# Altium project 8x8_Crosspoint_Switch.PrjPcb (part 1 of 4)
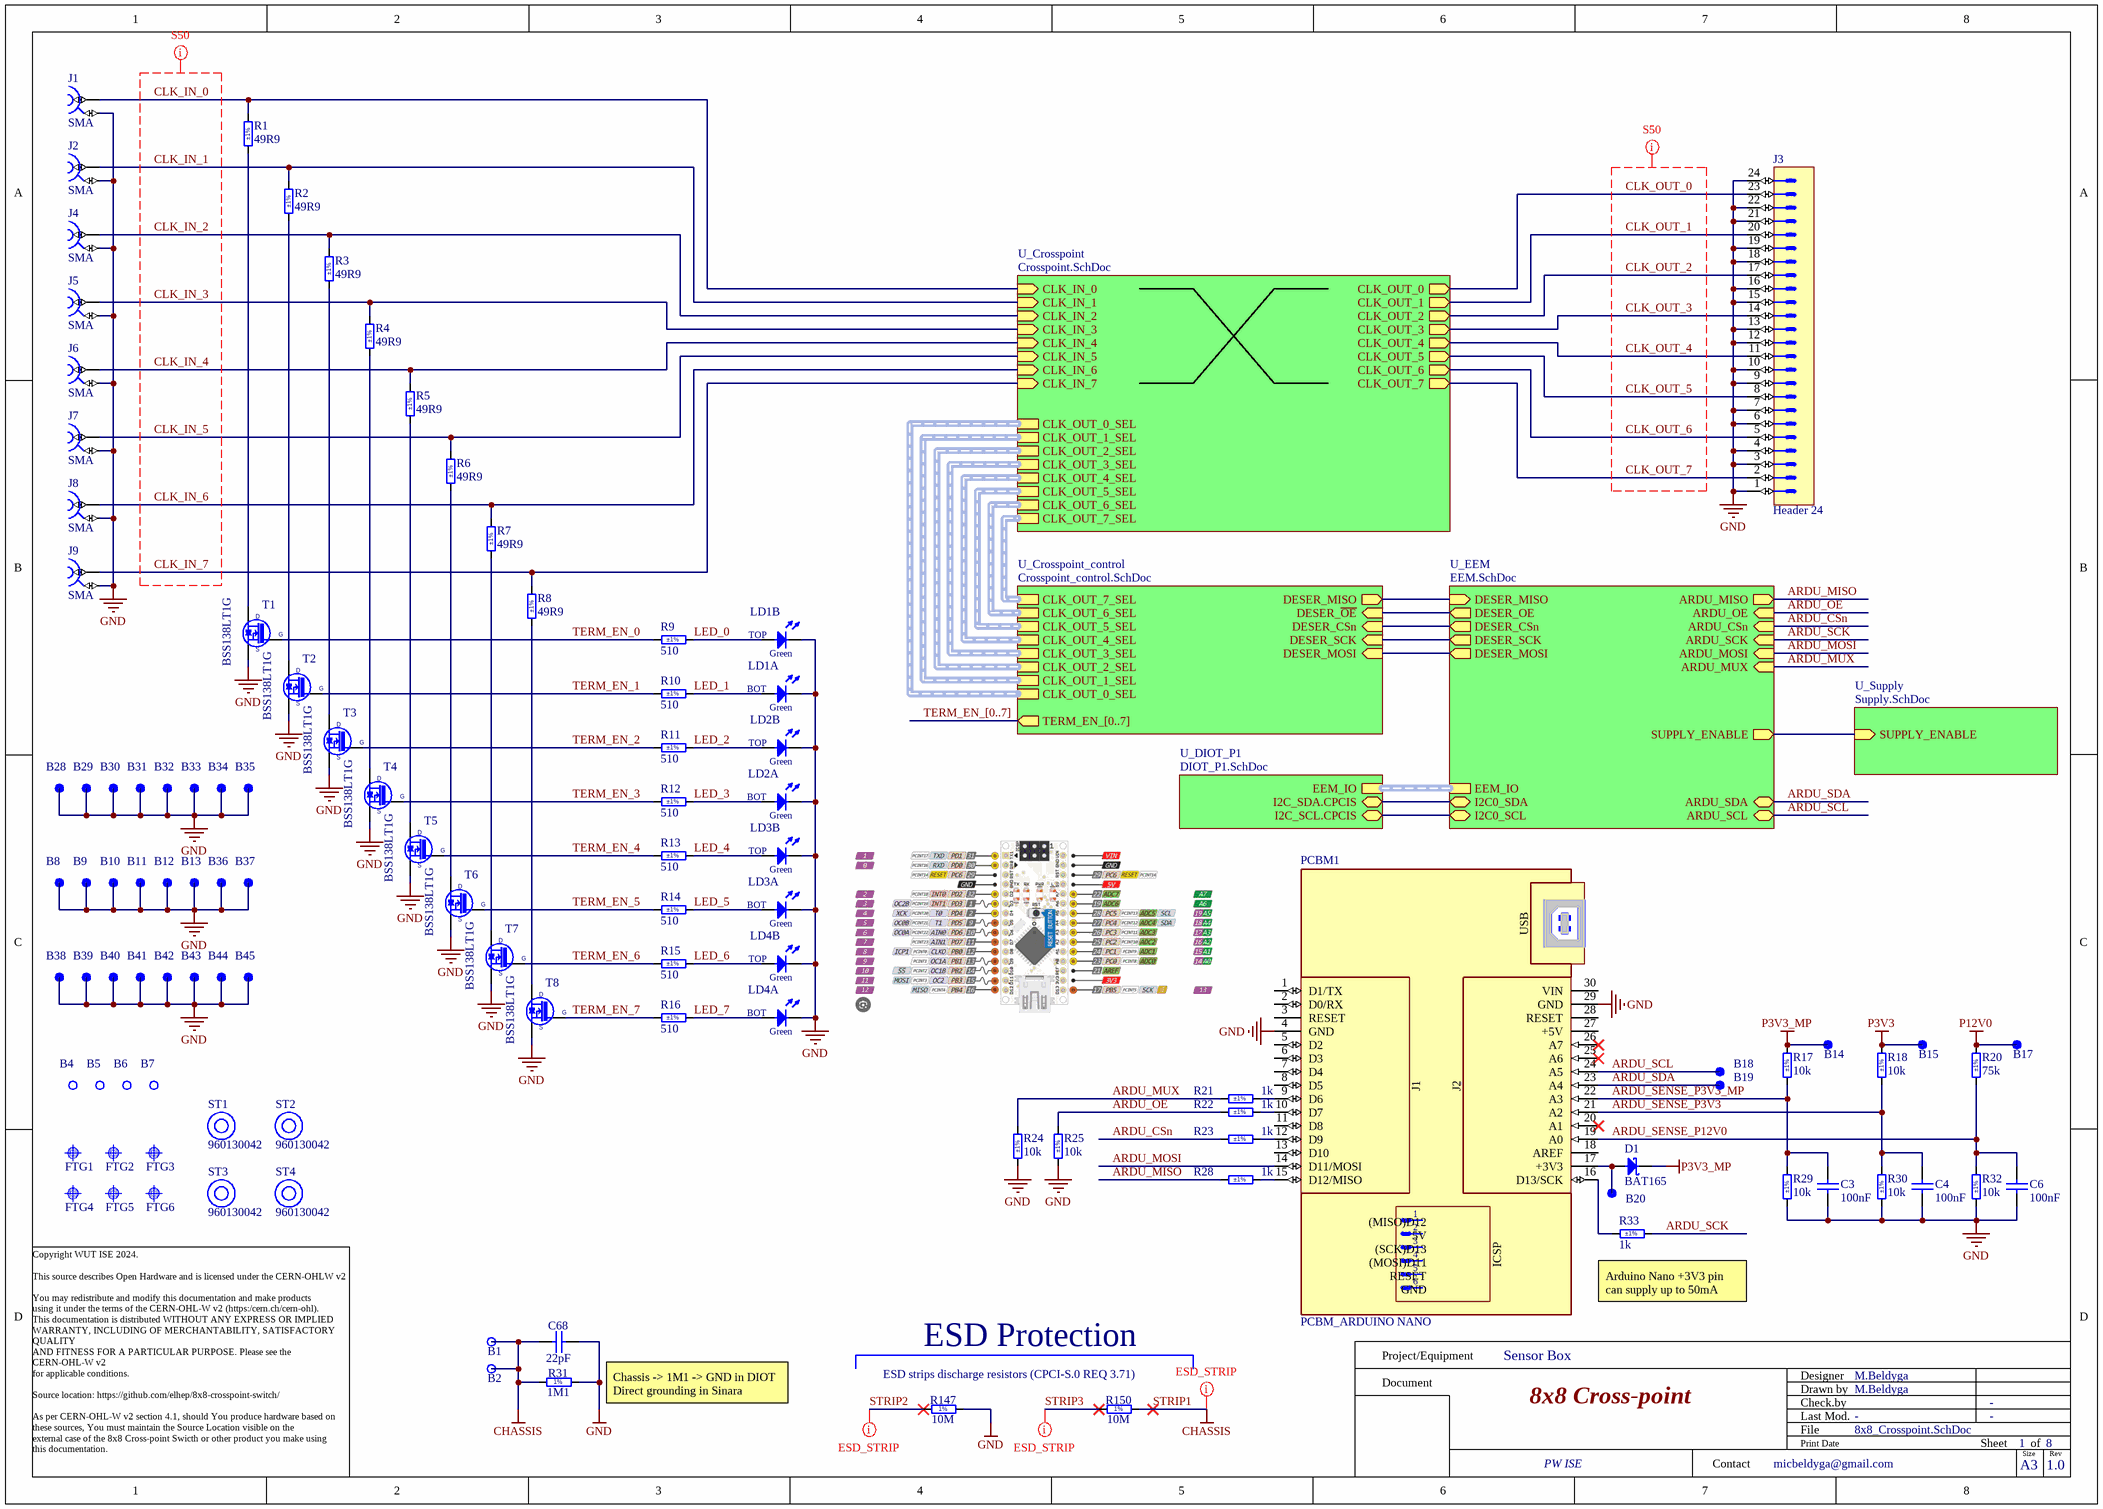
[diagram p0: 8x8_Crosspoint.SchDoc]
Revision: 1.0
8 sheets, 745 parts. Net scope: hierarchical (ports join the sheet entries above them; power ports are global).
Board file: 8x8_Crosspoint_Switch.PcbDoc
Sheets:
  8x8_Crosspoint.SchDoc
    U_Crosspoint = Crosspoint.SchDoc
      U_1-to-8_Fanout = 1-to-8_Fanout.SchDoc
      U_1-to-8_Fanout = 1-to-8_Fanout.SchDoc
      U_1-to-8_Fanout = 1-to-8_Fanout.SchDoc
      U_1-to-8_Fanout = 1-to-8_Fanout.SchDoc
      U_1-to-8_Fanout = 1-to-8_Fanout.SchDoc
      U_1-to-8_Fanout = 1-to-8_Fanout.SchDoc
      U_1-to-8_Fanout = 1-to-8_Fanout.SchDoc
      U_1-to-8_Fanout = 1-to-8_Fanout.SchDoc
      U_8-to-1_MUX = 8-to-1_MUX.SchDoc
      U_8-to-1_MUX = 8-to-1_MUX.SchDoc
      U_8-to-1_MUX = 8-to-1_MUX.SchDoc
      U_8-to-1_MUX = 8-to-1_MUX.SchDoc
      U_8-to-1_MUX = 8-to-1_MUX.SchDoc
      U_8-to-1_MUX = 8-to-1_MUX.SchDoc
      U_8-to-1_MUX = 8-to-1_MUX.SchDoc
      U_8-to-1_MUX = 8-to-1_MUX.SchDoc
    U_Crosspoint_control = Crosspoint_control.SchDoc
    U_DIOT_P1 = DIOT_P1.SchDoc
    U_EEM = EEM.SchDoc
    U_Supply = Supply.SchDoc

## Sheet 8x8_Crosspoint.SchDoc: 8x8 Cross-point
size A3; Author: M.Beldyga; CompanyName: WUT ISE; DrawnBy: M.Beldyga; Organization: WUT ISE; Address1: PW ISE; Address2: Nowowiejska 15/19 00-665 Warsaw; Address3: micbeldyga@gmail.com; SheetNumber: 1; SheetTotal: 8; ModifiedBy: -; CheckedDate: -; DivGrp: WUT ISE; Designer: M.Beldyga; ModifiedDate: -; ProjectName: Sensor Box

### Parts
B1  Plated Hole  [MTG270_500]  (value not drawn)  (no BOM)
B2  Plated Hole  [MTG270_500]  (value not drawn)  (no BOM)
B4  Plated Hole  [MTG320_550]  (value not drawn)  (no BOM)
B5  Plated Hole  [MTG320_550]  (value not drawn)  (no BOM)
B6  Plated Hole  [MTG320_550]  (value not drawn)  (no BOM)
B7  Plated Hole  [MTG320_550]  (value not drawn)  (no BOM)
B8  SMD Pad  [C100]  (value not drawn)  (no BOM)
B9  SMD Pad  [C100]  (value not drawn)  (no BOM)
B10  SMD Pad  [C100]  (value not drawn)  (no BOM)
B11  SMD Pad  [C100]  (value not drawn)  (no BOM)
B12  SMD Pad  [C100]  (value not drawn)  (no BOM)
B13  SMD Pad  [C100]  (value not drawn)  (no BOM)
B14  SMD Pad  [C100]  (value not drawn)  (no BOM)
B15  SMD Pad  [C100]  (value not drawn)  (no BOM)
B17  SMD Pad  [C100]  (value not drawn)  (no BOM)
B18  SMD Pad  [C100]  (value not drawn)  (no BOM)
B19  SMD Pad  [C100]  (value not drawn)  (no BOM)
B20  SMD Pad  [C100]  (value not drawn)  (no BOM)
B28  SMD Pad  [C100]  (value not drawn)  (no BOM)
B29  SMD Pad  [C100]  (value not drawn)  (no BOM)
B30  SMD Pad  [C100]  (value not drawn)  (no BOM)
B31  SMD Pad  [C100]  (value not drawn)  (no BOM)
B32  SMD Pad  [C100]  (value not drawn)  (no BOM)
B33  SMD Pad  [C100]  (value not drawn)  (no BOM)
B34  SMD Pad  [C100]  (value not drawn)  (no BOM)
B35  SMD Pad  [C100]  (value not drawn)  (no BOM)
B36  SMD Pad  [C100]  (value not drawn)  (no BOM)
B37  SMD Pad  [C100]  (value not drawn)  (no BOM)
B38  SMD Pad  [C100]  (value not drawn)  (no BOM)
B39  SMD Pad  [C100]  (value not drawn)  (no BOM)
B40  SMD Pad  [C100]  (value not drawn)  (no BOM)
B41  SMD Pad  [C100]  (value not drawn)  (no BOM)
B42  SMD Pad  [C100]  (value not drawn)  (no BOM)
B43  SMD Pad  [C100]  (value not drawn)  (no BOM)
B44  SMD Pad  [C100]  (value not drawn)  (no BOM)
B45  SMD Pad  [C100]  (value not drawn)  (no BOM)
C3  100nF  [CAPC1005X55N]
C4  100nF  [CAPC1005X55N]
C6  100nF  [CAPC1005X55N]
C68  22pF  [CAPC1005X55N]
D1  BAT165  [SOD2512X110N]
FTG1  Use only in PCB  [FIDUCIAL_TOP_S100-200]  (value not drawn)  (no BOM)
FTG2  Use only in PCB  [FIDUCIAL_TOP_S100-200]  (value not drawn)  (no BOM)
FTG3  Use only in PCB  [FIDUCIAL_TOP_S100-200]  (value not drawn)  (no BOM)
FTG4  Use only in PCB  [FIDUCIAL_TOP_S100-200]  (value not drawn)  (no BOM)
FTG5  Use only in PCB  [FIDUCIAL_TOP_S100-200]  (value not drawn)  (no BOM)
FTG6  Use only in PCB  [FIDUCIAL_TOP_S100-200]  (value not drawn)  (no BOM)
J1  SMA  [AMPHENOL_132203-12]
J2  SMA  [MOLEX_73251-2120]
J3  Header 24  [3M_N2524-6002RB]
J4  SMA  [AMPHENOL_132203-12]
J5  SMA  [MOLEX_73251-2120]
J6  SMA  [AMPHENOL_132203-12]
J7  SMA  [MOLEX_73251-2120]
J8  SMA  [AMPHENOL_132203-12]
J9  SMA  [MOLEX_73251-2120]
LD1  Green/Green  [LED_DIALIGHT_571-0122F]  (value not drawn)  (parts A,B of 2)
LD2  Green/Green  [LED_DIALIGHT_571-0122F]  (value not drawn)  (parts A,B of 2)
LD3  Green/Green  [LED_DIALIGHT_571-0122F]  (value not drawn)  (parts A,B of 2)
LD4  Green/Green  [LED_DIALIGHT_571-0122F]  (value not drawn)  (parts A,B of 2)
PCBM1  PCBM_ARDUINO NANO  [PCBM_ARDUINO NANO_a]
R1  49R9  Tolerance: ±1%  [RESC3225X70N]
R2  49R9  Tolerance: ±1%  [RESC3225X70N]
R3  49R9  Tolerance: ±1%  [RESC3225X70N]
R4  49R9  Tolerance: ±1%  [RESC3225X70N]
R5  49R9  Tolerance: ±1%  [RESC3225X70N]
R6  49R9  Tolerance: ±1%  [RESC3225X70N]
R7  49R9  Tolerance: ±1%  [RESC3225X70N]
R8  49R9  Tolerance: ±1%  [RESC3225X70N]
R9  510  Tolerance: ±1%  [RESC1005X40N]
R10  510  Tolerance: ±1%  [RESC1005X40N]
R11  510  Tolerance: ±1%  [RESC1005X40N]
R12  510  Tolerance: ±1%  [RESC1005X40N]
R13  510  Tolerance: ±1%  [RESC1005X40N]
R14  510  Tolerance: ±1%  [RESC1005X40N]
R15  510  Tolerance: ±1%  [RESC1005X40N]
R16  510  Tolerance: ±1%  [RESC1005X40N]
R17  10k  Tolerance: ±1%  [RESC1005X40N]
R18  10k  Tolerance: ±1%  [RESC1005X40N]
R20  75k  Tolerance: ±1%  [RESC1005X40N]
R21  1k  Tolerance: ±1%  [RESC1005X40N]
R22  1k  Tolerance: ±1%  [RESC1005X40N]
R23  1k  Tolerance: ±1%  [RESC1005X40N]
R24  10k  Tolerance: ±1%  [RESC1005X40N]
R25  10k  Tolerance: ±1%  [RESC1005X40N]
R28  1k  Tolerance: ±1%  [RESC1005X40N]
R29  10k  Tolerance: ±1%  [RESC1005X40N]
R30  10k  Tolerance: ±1%  [RESC1005X40N]
R31  1M1  [RESC2012X60N]
R32  10k  Tolerance: ±1%  [RESC1005X40N]
R33  1k  Tolerance: ±1%  [RESC1005X40N]
R147  10M  [RESC2113X55N]
R150  10M  [RESC2113X55N]
ST1  960130042  (mechanical)
ST2  960130042  (mechanical)
ST3  960130042  (mechanical)
ST4  960130042  (mechanical)
T1  BSS138LT1G  [SOT95P240X110-3N]
T2  BSS138LT1G  [SOT95P240X110-3N]
T3  BSS138LT1G  [SOT95P240X110-3N]
T4  BSS138LT1G  [SOT95P240X110-3N]
T5  BSS138LT1G  [SOT95P240X110-3N]
T6  BSS138LT1G  [SOT95P240X110-3N]
T7  BSS138LT1G  [SOT95P240X110-3N]
T8  BSS138LT1G  [SOT95P240X110-3N]

### Sub-sheets
U_Crosspoint = Crosspoint.SchDoc: CLK_IN_0 (in), CLK_IN_1 (in), CLK_IN_2 (in), CLK_IN_3 (in), CLK_IN_4 (in), CLK_IN_5 (in), CLK_IN_6 (in), CLK_IN_7 (in), CLK_OUT_0 (out), CLK_OUT_1 (out), CLK_OUT_2 (out), CLK_OUT_3 (out), CLK_OUT_4 (out), CLK_OUT_5 (out), CLK_OUT_6 (out), CLK_OUT_7 (out), CLK_OUT_0_SEL (harness CLK_SELECT), CLK_OUT_1_SEL (harness CLK_SELECT), CLK_OUT_2_SEL (harness CLK_SELECT), CLK_OUT_3_SEL (harness CLK_SELECT), CLK_OUT_4_SEL (harness CLK_SELECT), CLK_OUT_5_SEL (harness CLK_SELECT), CLK_OUT_6_SEL (harness CLK_SELECT), CLK_OUT_7_SEL (harness CLK_SELECT)
U_Crosspoint_control = Crosspoint_control.SchDoc: CLK_OUT_0_SEL (harness CLK_SELECT), CLK_OUT_1_SEL (harness CLK_SELECT), CLK_OUT_2_SEL (harness CLK_SELECT), CLK_OUT_3_SEL (harness CLK_SELECT), CLK_OUT_4_SEL (harness CLK_SELECT), CLK_OUT_5_SEL (harness CLK_SELECT), CLK_OUT_6_SEL (harness CLK_SELECT), CLK_OUT_7_SEL (harness CLK_SELECT), DESER_~{OE} (in), DESER_CSn (in), DESER_SCK (in), DESER_MOSI (in), DESER_MISO (out), TERM_EN_[0..7] (out)
U_DIOT_P1 = DIOT_P1.SchDoc: EEM_IO (harness EEM_LVDS), I2C_SDA.CPCIS (bidir), I2C_SCL.CPCIS (bidir)
U_EEM = EEM.SchDoc: ARDU_SDA (bidir), ARDU_SCL (bidir), EEM_IO (harness EEM_LVDS), I2C0_SCL (bidir), I2C0_SDA (bidir), SUPPLY_ENABLE (out), ARDU_MISO (out), ARDU_MOSI (in), ARDU_SCK (in), DESER_SCK (out), DESER_MOSI (out), DESER_CSn (out), ARDU_CSn (in), ARDU_OE (in), DESER_OE (out), DESER_MISO (in), ARDU_MUX (in)
U_Supply = Supply.SchDoc: SUPPLY_ENABLE (in)

### Nets
GND: B8.1 B9.1 B10.1 B11.1 B12.1 B13.1 B28.1 B29.1 B30.1 B31.1 B32.1 B33.1 B34.1 B35.1 B36.1 B37.1 B38.1 B39.1 B40.1 B41.1 B42.1 B43.1 B44.1 B45.1 C3.1 C4.1 C6.1 C68.2 J1.2 J2.2 J3.1 J3.3 J3.4 J3.6 J3.7 J3.9 J3.10 J3.12 J3.13 J3.15 J3.16 J3.18 J3.19 J3.21 J3.22 J3.24 J4.2 J5.2 J6.2 J7.2 J8.2 J9.2 LD1.1(C) LD1.3(C) LD2.1(C) LD2.3(C) LD3.1(C) LD3.3(C) LD4.1(C) LD4.3(C) PCBM1.4(GND) PCBM1.29(GND) R24.1 R25.1 R29.1 R30.1 R31.2 R32.1 R147.2 T1.2(S) T2.2(S) T3.2(S) T4.2(S) T5.2(S) T6.2(S) T7.2(S) T8.2(S)
P3V3: B15.1 R18.2
P3V3_MP: B14.1 D1.1(C) R17.2
P12V0: B17.1 R20.2
STRIP1: B1.1 B2.1 C68.1 R31.1 R150.2  [also labelled CHASSIS]
ARDU_CSn: R23.1 ; sheet U_EEM/ARDU_CSn
ARDU_MISO: R28.1 ; sheet U_EEM/ARDU_MISO
ARDU_MOSI: PCBM1.14(D11/MOSI) ; sheet U_EEM/ARDU_MOSI
ARDU_MUX: R21.1 R24.2 ; sheet U_EEM/ARDU_MUX
ARDU_OE: R22.1 R25.2 ; sheet U_EEM/ARDU_OE
ARDU_SCK: R33.2 ; sheet U_EEM/ARDU_SCK
ARDU_SCL: B18.1 PCBM1.24(A5) ; sheet U_EEM/ARDU_SCL
ARDU_SDA: B19.1 PCBM1.23(A4) ; sheet U_EEM/ARDU_SDA
ARDU_SENSE_P3V3: C4.2 PCBM1.21(A2) R18.1 R30.2
ARDU_SENSE_P3V3_MP: C3.2 PCBM1.22(A3) R17.1 R29.2
ARDU_SENSE_P12V0: C6.2 PCBM1.19(A0) R20.1 R32.2
CLK_IN_0: J1.1 R1.2 ; sheet U_Crosspoint/CLK_IN_0
CLK_IN_1: J2.1 R2.2 ; sheet U_Crosspoint/CLK_IN_1
CLK_IN_2: J4.1 R3.2 ; sheet U_Crosspoint/CLK_IN_2
CLK_IN_3: J5.1 R4.2 ; sheet U_Crosspoint/CLK_IN_3
CLK_IN_4: J6.1 R5.2 ; sheet U_Crosspoint/CLK_IN_4
CLK_IN_5: J7.1 R6.2 ; sheet U_Crosspoint/CLK_IN_5
CLK_IN_6: J8.1 R7.2 ; sheet U_Crosspoint/CLK_IN_6
CLK_IN_7: J9.1 R8.2 ; sheet U_Crosspoint/CLK_IN_7
CLK_OUT_0: J3.23 ; sheet U_Crosspoint/CLK_OUT_0
CLK_OUT_1: J3.20 ; sheet U_Crosspoint/CLK_OUT_1
CLK_OUT_2: J3.17 ; sheet U_Crosspoint/CLK_OUT_2
CLK_OUT_3: J3.14 ; sheet U_Crosspoint/CLK_OUT_3
CLK_OUT_4: J3.11 ; sheet U_Crosspoint/CLK_OUT_4
CLK_OUT_5: J3.8 ; sheet U_Crosspoint/CLK_OUT_5
CLK_OUT_6: J3.5 ; sheet U_Crosspoint/CLK_OUT_6
CLK_OUT_7: J3.2 ; sheet U_Crosspoint/CLK_OUT_7
DESER_CSn: sheet U_Crosspoint_control/DESER_CSn, sheet U_EEM/DESER_CSn
DESER_MISO: sheet U_Crosspoint_control/DESER_MISO, sheet U_EEM/DESER_MISO
DESER_MOSI: sheet U_Crosspoint_control/DESER_MOSI, sheet U_EEM/DESER_MOSI
DESER_~{OE}: sheet U_Crosspoint_control/DESER_~{OE}, sheet U_EEM/DESER_OE
DESER_SCK: sheet U_Crosspoint_control/DESER_SCK, sheet U_EEM/DESER_SCK
I2C0_SCL: sheet U_DIOT_P1/I2C_SCL.CPCIS, sheet U_EEM/I2C0_SCL
I2C0_SDA: sheet U_DIOT_P1/I2C_SDA.CPCIS, sheet U_EEM/I2C0_SDA
LED_0: LD1.4(A) R9.2
LED_1: LD1.2(A) R10.2
LED_2: LD2.4(A) R11.2
LED_3: LD2.2(A) R12.2
LED_4: LD3.4(A) R13.2
LED_5: LD3.2(A) R14.2
LED_6: LD4.4(A) R15.2
LED_7: LD4.2(A) R16.2
P3V7_EN: sheet U_EEM/SUPPLY_ENABLE, sheet U_Supply/SUPPLY_ENABLE
STRIP2: R147.1
STRIP3: R150.1
TERM_EN_0: R9.1 T1.1(G)
TERM_EN_1: R10.1 T2.1(G)
TERM_EN_2: R11.1 T3.1(G)
TERM_EN_3: R12.1 T4.1(G)
TERM_EN_4: R13.1 T5.1(G)
TERM_EN_5: R14.1 T6.1(G)
TERM_EN_6: R15.1 T7.1(G)
TERM_EN_7: R16.1 T8.1(G)
NetB20_1: B20.1 D1.2(A) PCBM1.17(+3V3)
NetPCBM1_9: PCBM1.9(D6) R21.2
NetPCBM1_10: PCBM1.10(D7) R22.2
NetPCBM1_12: PCBM1.12(D9) R23.2
NetPCBM1_15: PCBM1.15(D12/MISO) R28.2
NetPCBM1_16: PCBM1.16(D13/SCK) R33.1
NetR1_1: R1.1 T1.3(D)
NetR2_1: R2.1 T2.3(D)
NetR3_1: R3.1 T3.3(D)
NetR4_1: R4.1 T4.3(D)
NetR5_1: R5.1 T5.3(D)
NetR6_1: R6.1 T6.3(D)
NetR7_1: R7.1 T7.3(D)
NetR8_1: R8.1 T8.3(D)

Not connected (* = marked no-connect by the designer): B4 1; B5 1; B6 1; B7 1; PCBM1 1(D1/TX) 2(D0/RX) 3(RESET) 5(D2) 6(D3) 7(D4) 8(D5) 11(D8) 13(D10) 18(AREF) 20(A1)* 25(A6)* 26(A7)* 27(+5V) 28(RESET) 30(VIN)

### Buses and harness runs
bus TERM_EN_[0..7] = sheet U_Crosspoint_control/TERM_EN_[0..7]
harness sheet U_Crosspoint/CLK_OUT_0_SEL = sheet U_Crosspoint_control/CLK_OUT_0_SEL
harness sheet U_Crosspoint/CLK_OUT_1_SEL = sheet U_Crosspoint_control/CLK_OUT_1_SEL
harness sheet U_Crosspoint/CLK_OUT_2_SEL = sheet U_Crosspoint_control/CLK_OUT_2_SEL
harness sheet U_Crosspoint/CLK_OUT_3_SEL = sheet U_Crosspoint_control/CLK_OUT_3_SEL
harness sheet U_Crosspoint/CLK_OUT_4_SEL = sheet U_Crosspoint_control/CLK_OUT_4_SEL
harness sheet U_Crosspoint/CLK_OUT_5_SEL = sheet U_Crosspoint_control/CLK_OUT_5_SEL
harness sheet U_Crosspoint/CLK_OUT_6_SEL = sheet U_Crosspoint_control/CLK_OUT_6_SEL
harness sheet U_Crosspoint/CLK_OUT_7_SEL = sheet U_Crosspoint_control/CLK_OUT_7_SEL
harness sheet U_DIOT_P1/EEM_IO = sheet U_EEM/EEM_IO

### Layout directives
net class S50; net class CLK_OUT: CLK_OUT_0, CLK_OUT_1, CLK_OUT_2, CLK_OUT_3, CLK_OUT_4, CLK_OUT_5, CLK_OUT_6, CLK_OUT_7
net class S50; net class CLK_IN: CLK_IN_0, CLK_IN_1, CLK_IN_2, CLK_IN_3, CLK_IN_4, CLK_IN_5, CLK_IN_6, CLK_IN_7
net class ESD_STRIP: STRIP1, STRIP2, STRIP3

### Notes on the sheet
- (near R33) Arduino Nano +3V3 pin can supply up to 50mA
- Chassis -> 1M1 -> GND in DIOT
  Direct grounding in Sinara
- ESD strips discharge resistors (CPCI-S.0 REQ 3.71)
- ESD Protection
- Copyright WUT ISE 2024.
  This source describes Open Hardware and is licensed under the CERN-OHLW v2
  You may redistribute and modify this documentation and make products
  using it under the terms of the CERN-OHL-W v2 (https:/cern.ch/cern-ohl).
  This documentation is distributed WITHOUT ANY EXPRESS OR IMPLIED
  WARRANTY, INCLUDING OF MERCHANTABILITY, SATISFACTORY QUALITY
  AND FITNESS FOR A PARTICULAR PURPOSE. Please see the CERN-OHL-W v2
  for applicable conditions.
  Source location: https://github.com/elhep/8x8-crosspoint-switch/
  As per CERN-OHL-W v2 section 4.1, should You produce hardware based on
  these sources, You must maintain the Source Location visible on the
  external case of the 8x8 Cross-point Swicth or other product you make using
  this documentation.
- Project/Equipment
- Document
- Designer
- Drawn by
- Check.by
- Contact
- File
- Last Mod.
- Print Date
- Sheet
- Size
- A3
- of
- Rev
- (in symbol LED_DIALIGHT_571-0122F, part A) BOT; Green
- (in symbol LED_DIALIGHT_571-0122F, part B) TOP; Green
- (in symbol PCBM_ARDUINO NANO_a) USB; J1; J2; (MISO)D12; 5V; (SCK)D13; ICSP; (MOSI)D11
- (in symbol R0805_1M1_1%_0.125W_100PPM) 1%
- (in symbol R0805_10M_1%_0.125W_100PPM_VISHAY_CRCW e3) 1%

### Library data of the parts
B1 B2 = PLATED_HOLE2.7_PAD5.0: Single Terminal Socket; Part Description: Plated Through Hole: Hole Dia.=2.7mm Pad Dia.=5.0mm; Mounted: No; Part Number: PLATED_HOLE2.7_PAD5.0; Component Type: Standard (No BOM); Pin Count: 1; Family: Plated Hole; Socket: No; SMD: No; Sense: No; Status: None; ComponentHeight: 0mm; HelpURL: Undefined; Author: CERN DEM JMW; CreateDate: 9/27/2011; LatestRevisionDate: 9/27/2011; PackageDescription: Plated Through Hole: Hole Dia.=2.7mm Pad Dia.=5.0mm
B4-B7 = PLATED_HOLE3.2_PAD5.5: Single Terminal Socket; Part Description: Plated Through Hole: Hole Dia.=3.2mm Pad Dia.=5.5mm; Mounted: No; Part Number: PLATED_HOLE3.2_PAD5.5; Component Type: Standard (No BOM); Pin Count: 1; Family: Plated Hole; Socket: No; SMD: No; Sense: No; Status: None; ComponentHeight: 0mm; HelpURL: Undefined; Author: CERN DEM JMW; CreateDate: 10/1/2012; LatestRevisionDate: 10/1/2012; PackageDescription: Plated Through Hole: Hole Dia.=3.2mm Pad Dia.=5.5mm
B8-B15 B17-B20 B28-B45 = SMD_PAD_D1MM: Pad; Part Description: 1mm Diameter SMD Pad; Mounted: No; Part Number: SMD_PAD_D1MM; Component Type: Standard (No BOM); Pin Count: 1; Family: SMD Pad; Socket: No; SMD: Yes; Sense: No; Status: None; ComponentHeight: 0mm; HelpURL: Undefined; Author: CERN DEM JLC; CreateDate: 10/10/2017; LatestRevisionDate: 10/10/2017; PackageDescription: 1mm Diameter SMD Pad
C3 C4 C6 = CC0402_100NF_50V_10%_X7R: Non-polarised capacitor; Part Description: SMD Multilayer Chip Ceramic Capacitor; Manufacturer: GENERIC; Manufacturer1 Part Number: GRM155R71H104KE14D; Voltage: 50V; TC: X7R; Tolerance: ±10%; Part Number: CC0402_100NF_50V_10%_X7R; Component Kind: Standard; Component Type: Standard; Pin Count: 2; Value: 100nF; Status: None; Manufacturer Part Number: CC0402_100NF_50V_10%_X7R; Case: 0402; Mounted: Yes; Socket: No; SMD: Yes; Sense: No; Manufacturer1 Example: MURATA; Manufacturer1 ComponentHeight: 0.55mm; HelpURL: \\cern.ch\dfs\Applications\Altium\Datasheets\CC0402_MURATA_GRM155R71H104KE14D.pdf; Author: CERN DEM MR; CreateDate: 6/30/2017; LatestRevisionDate: 6/30/2017
C68 = CC0402_22PF_50V_5%_C0G: Non-polarised capacitor; Part Description: SMD Multilayer Chip Ceramic Capacitor; Manufacturer: GENERIC; Manufacturer1 Part Number: C0402C220J5GACTU; Voltage: 50V; TC: C0G/NP0; Tolerance: ±5%; Part Number: CC0402_22PF_50V_5%_C0G; Component Kind: Standard; Component Type: Standard; Pin Count: 2; Value: 22pF; Status: Preferred; Manufacturer Part Number: CC0402_22PF_50V_5%_C0G; Case: 0402; Mounted: Yes; Socket: No; SMD: Yes; Manufacturer1 Example: KEMET; Manufacturer1 ComponentHeight: 0.55mm; HelpURL: \\cern.ch\dfs\Applications\Altium\Datasheets\CC0402_C0G_KEMET_(Commercial Grade).pdf; Author: CERN DEM JLC; CreateDate: 2007-12-03; LatestRevisionDate: 2007-12-03; Sense: No
D1 = BAT165: Schottky Diode; Part Description: Medium Power AF Schottky Diode; Manufacturer: INFINEON; Voltage: 40V; Power: 750mA; PressFit: No; Bonding: No; Part Number: BAT165; Component Kind: Standard; Component Type: Standard; Device: BAT165; PackageDescription: Small Outline Diode (SOD-323), 1.70mm W X 1.25mm L X 1.10mm H body,  IPC Medium Density; Manufacturer Part Number: BAT165; Pin Count: 2; Case: SOD-323; Mounted: Yes; Socket: No; SMD: Yes; Sense: No; ComponentHeight: 1.1mm; HelpURL: \\cern.ch\dfs\Applications\Altium\Datasheets\BAT165.pdf; Author: CERN DEM JLC; CreateDate: 11/12/2014; LatestRevisionDate: 11/12/2014
FTG1-FTG6 = FIDUCIAL_TARGET_S100-200: Fiducial Target; Part Description: Square Fiducial Target, Top Layer, 1.0mm, Top Solder 2.0mm, Keepout =2.0mm; Mounted: No; Part Number: FIDUCIAL_TARGET_S100-200; Component Type: Standard (No BOM); Pin Count: 1; Family: Fiducial; Socket: No; SMD: Yes; Sense: No; Status: None; ComponentHeight: 0mm; HelpURL: Undefined; Author: CERN DEM JLC; CreateDate: 2/9/2010; LatestRevisionDate: 4/4/2012; PackageDescription: Square Fiducial Target, Top Layer, 1.0mm, Top Solder 2.0mm, Keepout =2.0mm
J1 J4 J6 J8 = 132203-12: RF Connector SMA Right Angle PCB Jack Through Hole 50 Ohm Bulkhead; Manufacturer: Amphenol Connex; Supplier: Mouser; Supplier Part Number: 523-132203-12; Manufacturer Part Number: 132203-12; RoHS: Yes; Category: RF / Coaxial Connectors; Stock: 515; Pricing: 1=20.22, 10=18.65, 50=18.65, 100=18.65, 1000=18.65, 10000=18.65 (USD); ComponentLink1URL: https://datasheet.ciiva.com/24241/132203-12-customer-drawing-24241088.pdf?src-supplier=Mouser; ComponentLink1Description: https://datasheet.ciiva.com/24241/132203-12-customer-drawing-24241088.pdf?src-supplier=Mouser; ComponentLink2URL: https://datasheet.ciiva.com/647/132203-12-647032.pdf?src-supplier=Digikey; ComponentLink2Description: https://datasheet.ciiva.com/647/132203-12-647032.pdf?src-supplier=Digikey
J2 J5 J7 J9 = CON_SMA_RA_SMD_73251-2120: 50 Ohm, SMA Edge Mount PCB, With Jam Nut And Lock Washer; Manufacturer: MOLEX; PressFit: No; Part Number: MOLEX_73251-2120; Component Kind: Standard; Component Type: Standard; Pin Count: 5; Family: SMA; Mounted: Yes; Socket: No; SMD: Yes; Sense: No; Status: None; Part Description: 50 Ohm, SMA Edge Mount PCB, With Jam Nut And Lock Washer; Manufacturer Part Number: 73251-2120; ComponentHeight: 5.75mm; HelpURL: \\cern.ch\dfs\Applications\Altium\Datasheets\MOLEX_73251-2121.pdf; Author: CERN DEM JLC; CreateDate: 26.10.2016; LatestRevisionDate: 26.10.2016
J3 = 3M_N2524-6002RB: Connector 24 Male; Part Description: 24 Contacts, Straight .100'' x .100'' Low Profile Four-Wall Header, (Solder Tail 2.84mm), 2500 Series; Manufacturer: 3M; PressFit: No; Part Number: 3M_N2524-6002RB; Component Kind: Standard; Component Type: Standard; Pin Count: 24; Family: Header 24; Mounted: Yes; Socket: No; SMD: No; Sense: No; Status: None; Manufacturer Part Number: N2524-6002RB; ComponentHeight: 10.03mm; HelpURL: \\cern.ch\dfs\Applications\Altium\Datasheets\3M_N2524-6002RB.pdf; Author: CERN DEM JLC; CreateDate: 2/11/2009; LatestRevisionDate: 10/27/2022
LD1-LD4 = LED_DIALIGHT_571-0122F: LED x2 Green 1C2A-BOT_3C4A-TOP; Part Description: Dual 2mm Green LEDs CBI® Circuit Board Indicator (without positioning pins); PressFit: No; Bonding: No; Part Number: LED_DIALIGHT_571-0122F; Component Kind: Standard; Component Type: Standard; Color: Green/Green; PackageDescription: 2x 2mm Red LED PCB Edge Mounting (without positioning pins) DIALIGHT 571 Serie; Manufacturer: DIALIGHT; Manufacturer Part Number: 571-0122F; Pin Count: 4; Mounted: Yes; Socket: No; SMD: No; Sense: No; ComponentHeight: 8.6mm; HelpURL: \\cern.ch\dfs\Applications\Altium\Datasheets\LED_DIALIGHT_571-0122F.pdf; Author: CERN DEM JLC; CreateDate: 11/9/2009; LatestRevisionDate: 3/17/2010
PCBM1 = PCBM_ARDUINO NANO_a: Arduino NANO Printed Circuit Board Module; PressFit: No; Sense Comment: Non-washable; Bonding: No; Part Number: PCBM_ARDUINO NANO_a; Component Kind: Standard; Component Type: Standard; Device: PCBM_ARDUINO NANO; PackageDescription: Microcontroller Board Arduino NANO; Part Description: Arduino NANO Printed Circuit Board Module; Manufacturer: ARDUINO; Manufacturer Part Number: ARDUINO NANO; Pin Count: 0; Mounted: Yes; Socket: No; SMD: No; Sense: Yes; ComponentHeight: 12.6mm; Author: CERN DEM HF; HelpURL: \\cern.ch\dfs\Applications\Altium\Datasheets\PCBM_ARDUINO NANO.pdf; CreateDate: 10/5/2022; LatestRevisionDate: 10/5/2022
R1-R8 = R1210_49R9_1%_0.5W_100PPM_VISHAY_CRCW: Resistor - 1%; Part Description: Thick Film Chip Resistor; Manufacturer: VISHAY DRALORIC; Manufacturer Part Number: CRCW121049R9FK; Power: 0.5W; TC: ±100ppm/°C; PressFit: No; Part Number: R1210_49R9_1%_0.5W_100PPM_VISHAY_CRCW; Component Kind: Standard; Component Type: Standard; Pin Count: 2; Value: 49R9; Status: None; Case: 1210; Mounted: Yes; Sense: No; Socket: No; SMD: Yes; ComponentHeight: 0.7mm; HelpURL: \\cern.ch\dfs\Applications\Altium\Datasheets\R1210_VISHAY_CRCW1210.pdf; Author: CERN DEM JMW; CreateDate: 8/6/2014; LatestRevisionDate: 8/6/2014
R9-R16 = R0402_510R_1%_0.0625W_100PPM: Resistor - 1%; Part Description: General Purpose Thick Film Chip Resistor; Manufacturer: GENERIC; Manufacturer1 Part Number: 232270675101L; TC: ±100ppm/°C; PressFit: No; Part Number: R0402_510R_1%_0.0625W_100PPM; Component Kind: Standard; Component Type: Standard; Pin Count: 2; Value: 510; Status: Not Recommended; Power: 0.0625W; Manufacturer Part Number: R0402_510R_1%_0.0625W_100PPM; Case: 0402; Mounted: Yes; Sense: No; Socket: No; SMD: Yes; Manufacturer1 Example: YAGEO PHYCOMP; Manufacturer1 ComponentHeight: 0.4mm; HelpURL: \\cern.ch\dfs\Applications\Altium\Datasheets\R0402_Phycomp_RC0402.pdf; Author: CERN DEM JLC; CreateDate: 12/3/2007; LatestRevisionDate: 10/17/2012
R17 R18 R24 R25 R29 R30 R32 = R0402_10K_1%_0.0625W_100PPM: Resistor - 1%; Part Description: General Purpose Thick Film Chip Resistor; Manufacturer: GENERIC; Manufacturer1 Part Number: 232270671003L; TC: ±100ppm/°C; PressFit: No; Part Number: R0402_10K_1%_0.0625W_100PPM; Component Kind: Standard; Component Type: Standard; Pin Count: 2; Value: 10k; Status: Not Recommended; Power: 0.0625W; Manufacturer Part Number: R0402_10K_1%_0.0625W_100PPM; Case: 0402; Mounted: Yes; Sense: No; Socket: No; SMD: Yes; Manufacturer1 Example: YAGEO PHYCOMP; Manufacturer1 ComponentHeight: 0.4mm; HelpURL: \\cern.ch\dfs\Applications\Altium\Datasheets\R0402_Phycomp_RC0402.pdf; Author: CERN DEM JLC; CreateDate: 12/3/2007; LatestRevisionDate: 10/17/2012
R20 = R0402_75K_1%_0.0625W_100PPM: Resistor - 1%; Part Description: General Purpose Thick Film Chip Resistor; Manufacturer: GENERIC; Manufacturer1 Part Number: 232270677503L; TC: ±100ppm/°C; PressFit: No; Part Number: R0402_75K_1%_0.0625W_100PPM; Component Kind: Standard; Component Type: Standard; Pin Count: 2; Value: 75k; Status: Not Recommended; Power: 0.0625W; Manufacturer Part Number: R0402_75K_1%_0.0625W_100PPM; Case: 0402; Mounted: Yes; Sense: No; Socket: No; SMD: Yes; Manufacturer1 Example: YAGEO PHYCOMP; Manufacturer1 ComponentHeight: 0.4mm; HelpURL: \\cern.ch\dfs\Applications\Altium\Datasheets\R0402_Phycomp_RC0402.pdf; Author: CERN DEM JLC; CreateDate: 12/3/2007; LatestRevisionDate: 10/17/2012
R21-R23 R28 R33 = R0402_1K_1%_0.0625W_100PPM: Resistor - 1%; Part Description: General Purpose Thick Film Chip Resistor; Manufacturer: GENERIC; Manufacturer1 Part Number: 232270671002L; TC: ±100ppm/°C; PressFit: No; Part Number: R0402_1K_1%_0.0625W_100PPM; Component Kind: Standard; Component Type: Standard; Pin Count: 2; Value: 1k; Status: Not Recommended; Power: 0.0625W; Manufacturer Part Number: R0402_1K_1%_0.0625W_100PPM; Case: 0402; Mounted: Yes; Sense: No; Socket: No; SMD: Yes; Manufacturer1 Example: YAGEO PHYCOMP; Manufacturer1 ComponentHeight: 0.4mm; HelpURL: \\cern.ch\dfs\Applications\Altium\Datasheets\R0402_Phycomp_RC0402.pdf; Author: CERN DEM JLC; CreateDate: 12/3/2007; LatestRevisionDate: 10/17/2012
R31 = R0805_1M1_1%_0.125W_100PPM: Resistor - 1%; Part Description: General Purpose Thick Film Chip Resistor; Manufacturer: GENERIC; Manufacturer1 Part Number: NRC10F1104TRF; PressFit: No; Part Number: R0805_1M1_1%_0.125W_100PPM; Component Kind: Standard; Component Type: Standard; Pin Count: 2; Value: 1M1; Status: Preferred; Manufacturer Part Number: R0805_1M1_1%_0.125W_100PPM; Case: 0805; Mounted: Yes; Sense: No; Socket: No; SMD: Yes; Manufacturer1 Example: NIC COMPONENT; Manufacturer1 ComponentHeight: 0.6mm; HelpURL: \\cern.ch\dfs\Applications\Altium\Datasheets\R0805_NIC_NRC.pdf; Author: CERN DEM JLC; CreateDate: 03/12/2007; LatestRevisionDate: 13/03/2008
R147 R150 = R0805_10M_1%_0.125W_100PPM_VISHAY_CRCW e3: Resistor - 1%; Part Description: 150V, Standard Thick Film Chip Resistor; Manufacturer: VISHAY DALE; Manufacturer Part Number: CRCW080510M0FKEA; Power: 0.125W; TC: ±100ppm/°C; PressFit: No; Part Number: R0805_10M_1%_0.125W_100PPM_VISHAY_CRCW e3; Component Kind: Standard; Component Type: Standard; Pin Count: 2; Value: 10M; Status: None; Tolerance: ±1%; Case: 0805; Mounted: Yes; Sense: No; Socket: No; SMD: Yes; ComponentHeight: 0.5mm; HelpURL: \\cern.ch\dfs\Applications\Altium\Datasheets\R0805_VISHAY_CRCW e3.pdf; Author: CERN DEM BC; CreateDate: 2019-11-12; LatestRevisionDate: 2019-11-12
ST1-ST4 = 960130042: WA-SPaRO Round Plastic Spacer; Manufacturer: Wurth Electronics; Threaded/Unthreaded: Unthreaded; Gender: Female, Female; Supplier: Digikey; Supplier Part Number: 732-12711-ND; Manufacturer Part Number: 960130042; RoHS: No; Category: Spacers, Standoffs; Stock: 764; Pricing: 1=0.3, 10=0.278, 50=0.253, 100=0.228, 250=0.203, 500=0.177 (USD); Material: Polyamide; Color: Black; Series: WA-SPARO; ComponentLink1URL: https://katalog.we-online.de/em/datasheet/960xxxxxx.pdf?src-supplier=Digikey; ComponentLink1Description: https://katalog.we-online.de/em/datasheet/960xxxxxx.pdf?src-supplier=Digikey
T1-T8 = BSS138LT1G: N-CHANNEL MOSFET WITH DIODE; Part Description: 50V, 200mA N-Channel Enhancement Mode Field-Effect Transistor; Manufacturer: ON SEMICONDUCTOR; PressFit: No; Bonding: No; Part Number: BSS138LT1G; Component Kind: Standard; Component Type: Standard; Device: BSS138LT1G; PackageDescription: SOT23, 0.95mm Pitch; 3 Pin, 1.40mm W X 3.00mm L X 1.10mm H body, IPC Medium Density; Manufacturer Part Number: BSS138L; Pin Count: 3; Case: SOT23-3; Mounted: Yes; Socket: No; SMD: Yes; Sense: No; ComponentHeight: 1.11mm; HelpURL: \\cern.ch\dfs\Applications\Altium\Datasheets\BSS138LT1G.pdf; Author: CERN DEM JLC; CreateDate: 3/23/2009; LatestRevisionDate: 5/25/2022

## Sheet Crosspoint.SchDoc: Cross-point
size A3; Author: M.Beldyga; CompanyName: WUT ISE; DrawnBy: M.Beldyga; Organization: WUT ISE; Address1: PW ISE; Address2: Nowowiejska 15/19 00-665 Warsaw; Address3: micbeldyga@gmail.com; SheetNumber: 2; SheetTotal: 8; ModifiedBy: -; CheckedDate: -; DivGrp: WUT ISE; Designer: M.Beldyga; ModifiedDate: -; ProjectName: Sensor Box
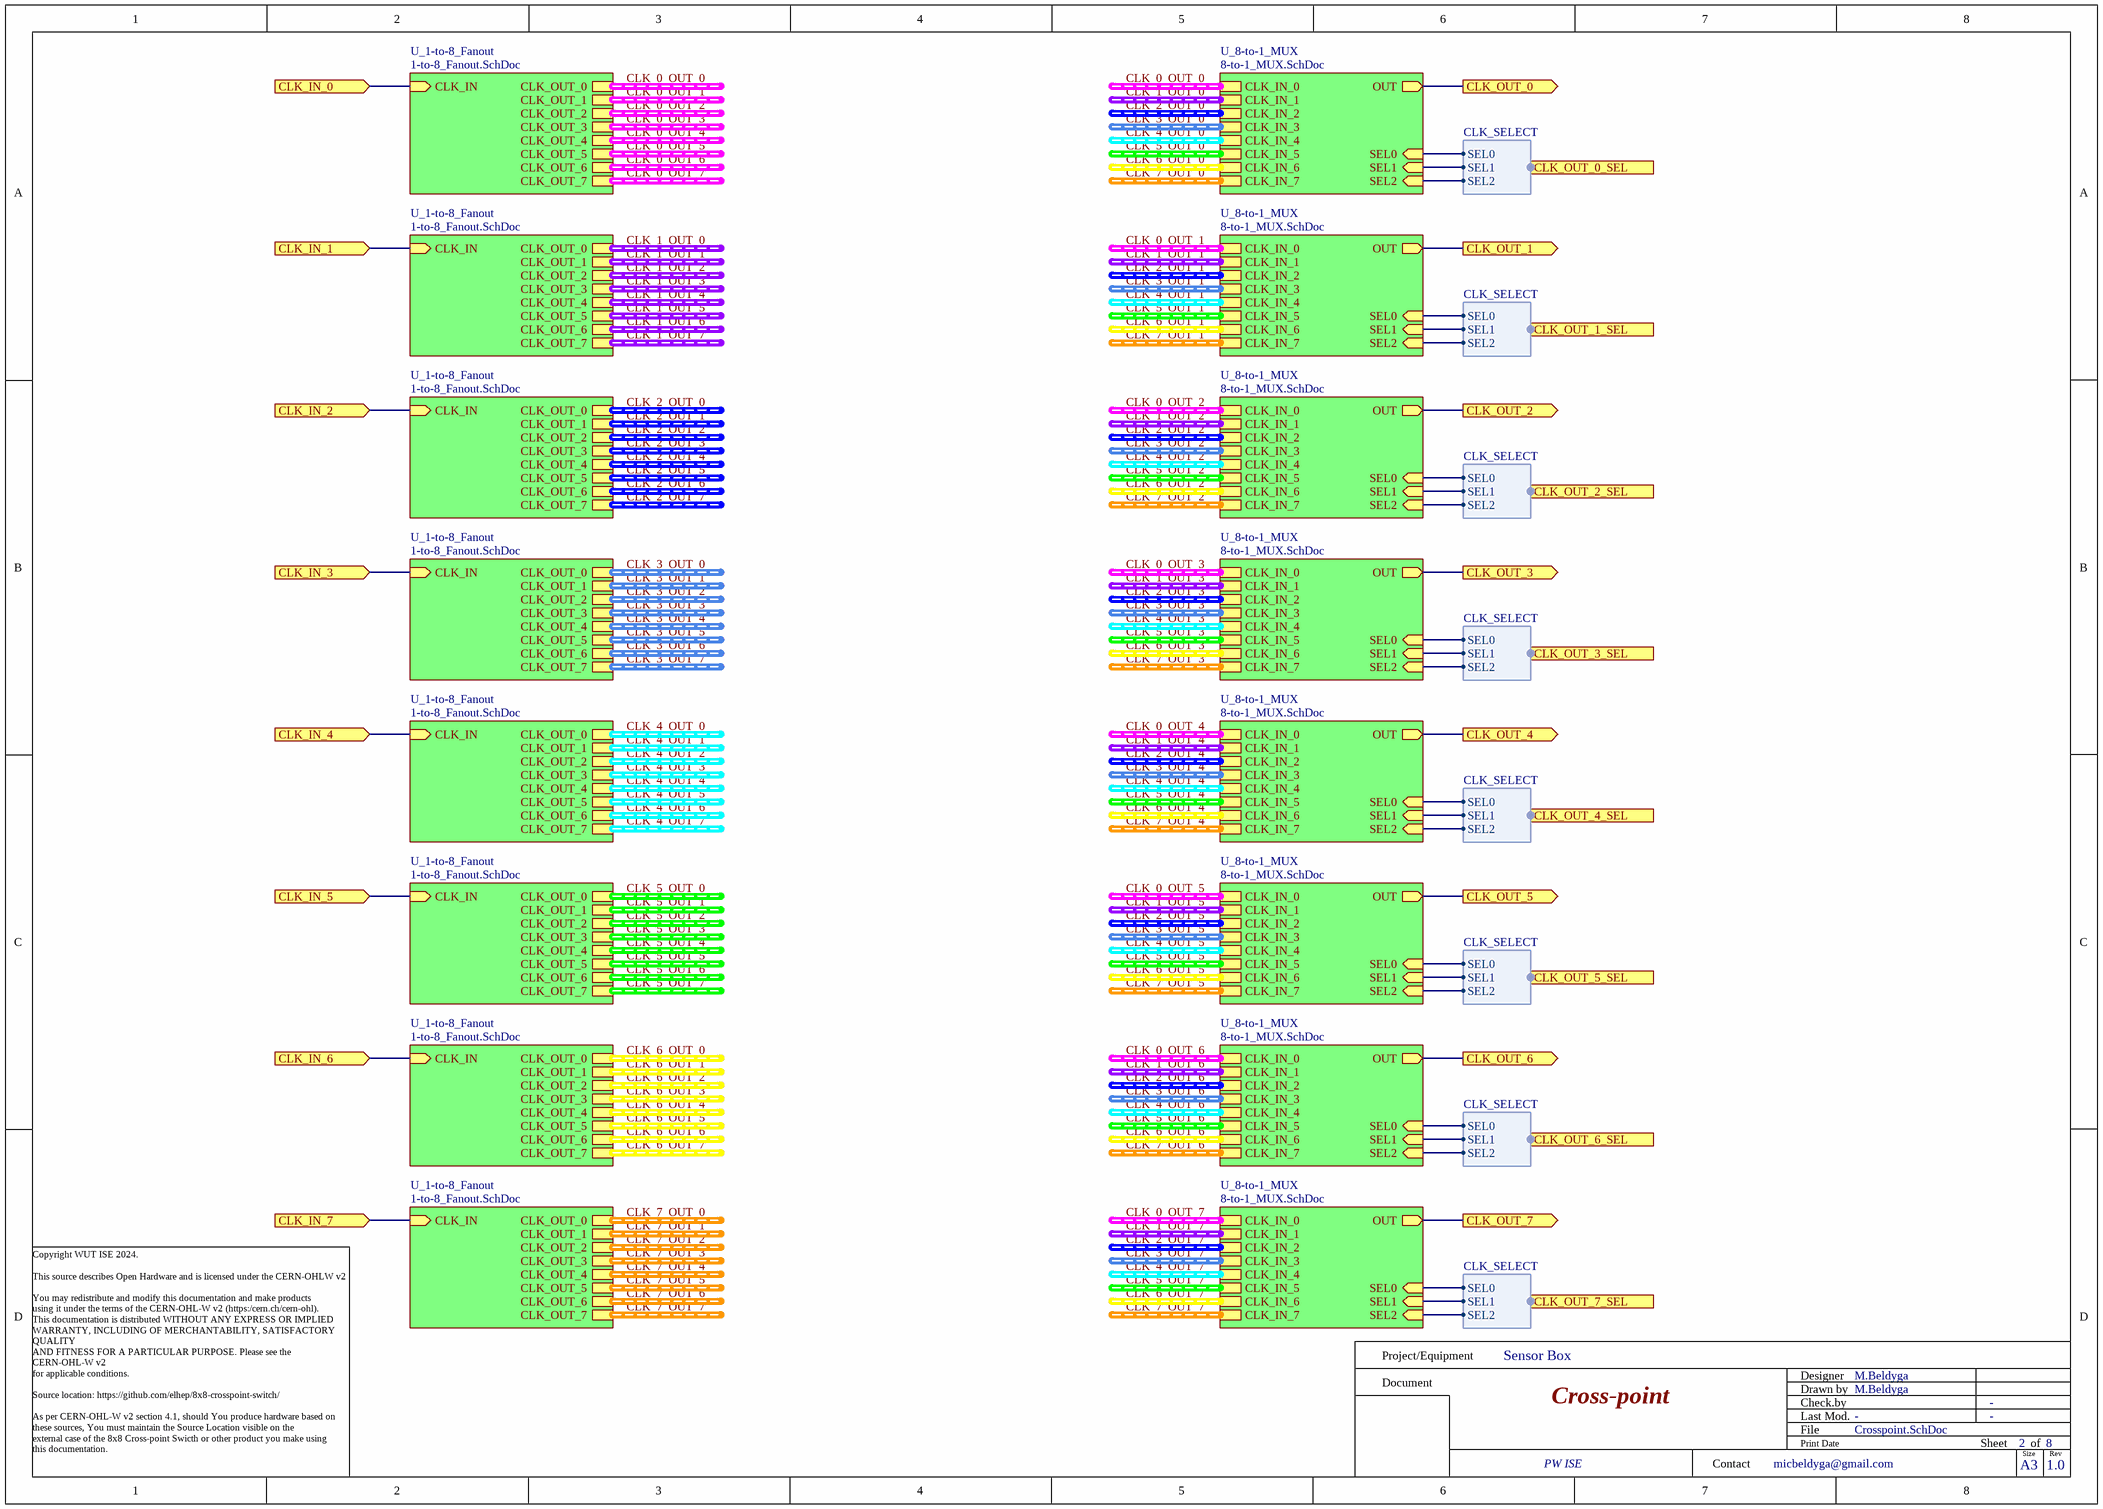
[diagram p1: Crosspoint.SchDoc]

### Sub-sheets
U_1-to-8_Fanout = 1-to-8_Fanout.SchDoc: CLK_IN (in), CLK_OUT_0 (harness DIFF_CLK), CLK_OUT_1 (harness DIFF_CLK), CLK_OUT_2 (harness DIFF_CLK), CLK_OUT_3 (harness DIFF_CLK), CLK_OUT_4 (harness DIFF_CLK), CLK_OUT_5 (harness DIFF_CLK), CLK_OUT_6 (harness DIFF_CLK), CLK_OUT_7 (harness DIFF_CLK)
U_1-to-8_Fanout = 1-to-8_Fanout.SchDoc: CLK_IN (in), CLK_OUT_0 (harness DIFF_CLK), CLK_OUT_1 (harness DIFF_CLK), CLK_OUT_2 (harness DIFF_CLK), CLK_OUT_3 (harness DIFF_CLK), CLK_OUT_4 (harness DIFF_CLK), CLK_OUT_5 (harness DIFF_CLK), CLK_OUT_6 (harness DIFF_CLK), CLK_OUT_7 (harness DIFF_CLK)
U_1-to-8_Fanout = 1-to-8_Fanout.SchDoc: CLK_IN (in), CLK_OUT_0 (harness DIFF_CLK), CLK_OUT_1 (harness DIFF_CLK), CLK_OUT_2 (harness DIFF_CLK), CLK_OUT_3 (harness DIFF_CLK), CLK_OUT_4 (harness DIFF_CLK), CLK_OUT_5 (harness DIFF_CLK), CLK_OUT_6 (harness DIFF_CLK), CLK_OUT_7 (harness DIFF_CLK)
U_1-to-8_Fanout = 1-to-8_Fanout.SchDoc: CLK_IN (in), CLK_OUT_0 (harness DIFF_CLK), CLK_OUT_1 (harness DIFF_CLK), CLK_OUT_2 (harness DIFF_CLK), CLK_OUT_3 (harness DIFF_CLK), CLK_OUT_4 (harness DIFF_CLK), CLK_OUT_5 (harness DIFF_CLK), CLK_OUT_6 (harness DIFF_CLK), CLK_OUT_7 (harness DIFF_CLK)
U_1-to-8_Fanout = 1-to-8_Fanout.SchDoc: CLK_IN (in), CLK_OUT_0 (harness DIFF_CLK), CLK_OUT_1 (harness DIFF_CLK), CLK_OUT_2 (harness DIFF_CLK), CLK_OUT_3 (harness DIFF_CLK), CLK_OUT_4 (harness DIFF_CLK), CLK_OUT_5 (harness DIFF_CLK), CLK_OUT_6 (harness DIFF_CLK), CLK_OUT_7 (harness DIFF_CLK)
U_1-to-8_Fanout = 1-to-8_Fanout.SchDoc: CLK_IN (in), CLK_OUT_0 (harness DIFF_CLK), CLK_OUT_1 (harness DIFF_CLK), CLK_OUT_2 (harness DIFF_CLK), CLK_OUT_3 (harness DIFF_CLK), CLK_OUT_4 (harness DIFF_CLK), CLK_OUT_5 (harness DIFF_CLK), CLK_OUT_6 (harness DIFF_CLK), CLK_OUT_7 (harness DIFF_CLK)
U_1-to-8_Fanout = 1-to-8_Fanout.SchDoc: CLK_IN (in), CLK_OUT_0 (harness DIFF_CLK), CLK_OUT_1 (harness DIFF_CLK), CLK_OUT_2 (harness DIFF_CLK), CLK_OUT_3 (harness DIFF_CLK), CLK_OUT_4 (harness DIFF_CLK), CLK_OUT_5 (harness DIFF_CLK), CLK_OUT_6 (harness DIFF_CLK), CLK_OUT_7 (harness DIFF_CLK)
U_1-to-8_Fanout = 1-to-8_Fanout.SchDoc: CLK_IN (in), CLK_OUT_0 (harness DIFF_CLK), CLK_OUT_1 (harness DIFF_CLK), CLK_OUT_2 (harness DIFF_CLK), CLK_OUT_3 (harness DIFF_CLK), CLK_OUT_4 (harness DIFF_CLK), CLK_OUT_5 (harness DIFF_CLK), CLK_OUT_6 (harness DIFF_CLK), CLK_OUT_7 (harness DIFF_CLK)
U_8-to-1_MUX = 8-to-1_MUX.SchDoc: SEL1 (in), SEL2 (in), SEL0 (in), OUT (out), CLK_IN_0 (harness DIFF_CLK), CLK_IN_1 (harness DIFF_CLK), CLK_IN_2 (harness DIFF_CLK), CLK_IN_3 (harness DIFF_CLK), CLK_IN_4 (harness DIFF_CLK), CLK_IN_5 (harness DIFF_CLK), CLK_IN_6 (harness DIFF_CLK), CLK_IN_7 (harness DIFF_CLK)
U_8-to-1_MUX = 8-to-1_MUX.SchDoc: SEL1 (in), SEL2 (in), SEL0 (in), OUT (out), CLK_IN_0 (harness DIFF_CLK), CLK_IN_1 (harness DIFF_CLK), CLK_IN_2 (harness DIFF_CLK), CLK_IN_3 (harness DIFF_CLK), CLK_IN_4 (harness DIFF_CLK), CLK_IN_5 (harness DIFF_CLK), CLK_IN_6 (harness DIFF_CLK), CLK_IN_7 (harness DIFF_CLK)
U_8-to-1_MUX = 8-to-1_MUX.SchDoc: SEL1 (in), SEL2 (in), SEL0 (in), OUT (out), CLK_IN_0 (harness DIFF_CLK), CLK_IN_1 (harness DIFF_CLK), CLK_IN_2 (harness DIFF_CLK), CLK_IN_3 (harness DIFF_CLK), CLK_IN_4 (harness DIFF_CLK), CLK_IN_5 (harness DIFF_CLK), CLK_IN_6 (harness DIFF_CLK), CLK_IN_7 (harness DIFF_CLK)
U_8-to-1_MUX = 8-to-1_MUX.SchDoc: SEL1 (in), SEL2 (in), SEL0 (in), OUT (out), CLK_IN_0 (harness DIFF_CLK), CLK_IN_1 (harness DIFF_CLK), CLK_IN_2 (harness DIFF_CLK), CLK_IN_3 (harness DIFF_CLK), CLK_IN_4 (harness DIFF_CLK), CLK_IN_5 (harness DIFF_CLK), CLK_IN_6 (harness DIFF_CLK), CLK_IN_7 (harness DIFF_CLK)
U_8-to-1_MUX = 8-to-1_MUX.SchDoc: SEL1 (in), SEL2 (in), SEL0 (in), OUT (out), CLK_IN_0 (harness DIFF_CLK), CLK_IN_1 (harness DIFF_CLK), CLK_IN_2 (harness DIFF_CLK), CLK_IN_3 (harness DIFF_CLK), CLK_IN_4 (harness DIFF_CLK), CLK_IN_5 (harness DIFF_CLK), CLK_IN_6 (harness DIFF_CLK), CLK_IN_7 (harness DIFF_CLK)
U_8-to-1_MUX = 8-to-1_MUX.SchDoc: SEL1 (in), SEL2 (in), SEL0 (in), OUT (out), CLK_IN_0 (harness DIFF_CLK), CLK_IN_1 (harness DIFF_CLK), CLK_IN_2 (harness DIFF_CLK), CLK_IN_3 (harness DIFF_CLK), CLK_IN_4 (harness DIFF_CLK), CLK_IN_5 (harness DIFF_CLK), CLK_IN_6 (harness DIFF_CLK), CLK_IN_7 (harness DIFF_CLK)
U_8-to-1_MUX = 8-to-1_MUX.SchDoc: SEL1 (in), SEL2 (in), SEL0 (in), OUT (out), CLK_IN_0 (harness DIFF_CLK), CLK_IN_1 (harness DIFF_CLK), CLK_IN_2 (harness DIFF_CLK), CLK_IN_3 (harness DIFF_CLK), CLK_IN_4 (harness DIFF_CLK), CLK_IN_5 (harness DIFF_CLK), CLK_IN_6 (harness DIFF_CLK), CLK_IN_7 (harness DIFF_CLK)
U_8-to-1_MUX = 8-to-1_MUX.SchDoc: SEL1 (in), SEL2 (in), SEL0 (in), OUT (out), CLK_IN_0 (harness DIFF_CLK), CLK_IN_1 (harness DIFF_CLK), CLK_IN_2 (harness DIFF_CLK), CLK_IN_3 (harness DIFF_CLK), CLK_IN_4 (harness DIFF_CLK), CLK_IN_5 (harness DIFF_CLK), CLK_IN_6 (harness DIFF_CLK), CLK_IN_7 (harness DIFF_CLK)

### Ports
CLK_IN_0 (in), CLK_IN_1 (in), CLK_IN_2 (in), CLK_IN_3 (in), CLK_IN_4 (in), CLK_IN_5 (in), CLK_IN_6 (in), CLK_IN_7 (in), CLK_OUT_0 (out), CLK_OUT_0_SEL (out, harness CLK_SELECT), CLK_OUT_1 (out), CLK_OUT_1_SEL (out, harness CLK_SELECT), CLK_OUT_2 (out), CLK_OUT_2_SEL (out, harness CLK_SELECT), CLK_OUT_3 (out), CLK_OUT_3_SEL (out, harness CLK_SELECT), CLK_OUT_4 (out), CLK_OUT_4_SEL (out, harness CLK_SELECT), CLK_OUT_5 (out), CLK_OUT_5_SEL (out, harness CLK_SELECT), CLK_OUT_6 (out), CLK_OUT_6_SEL (out, harness CLK_SELECT), CLK_OUT_7 (out), CLK_OUT_7_SEL (out, harness CLK_SELECT)

### Harnesses
CLK_SELECT: SEL0, SEL1, SEL2

### Nets
CLK_IN_0: port CLK_IN_0, sheet U_1-to-8_Fanout/CLK_IN
CLK_IN_1: port CLK_IN_1, sheet U_1-to-8_Fanout/CLK_IN
CLK_IN_2: port CLK_IN_2, sheet U_1-to-8_Fanout/CLK_IN
CLK_IN_3: port CLK_IN_3, sheet U_1-to-8_Fanout/CLK_IN
CLK_IN_4: port CLK_IN_4, sheet U_1-to-8_Fanout/CLK_IN
CLK_IN_5: port CLK_IN_5, sheet U_1-to-8_Fanout/CLK_IN
CLK_IN_6: port CLK_IN_6, sheet U_1-to-8_Fanout/CLK_IN
CLK_IN_7: port CLK_IN_7, sheet U_1-to-8_Fanout/CLK_IN
CLK_OUT_0: port CLK_OUT_0, sheet U_8-to-1_MUX/OUT
CLK_OUT_1: port CLK_OUT_1, sheet U_8-to-1_MUX/OUT
CLK_OUT_2: port CLK_OUT_2, sheet U_8-to-1_MUX/OUT
CLK_OUT_3: port CLK_OUT_3, sheet U_8-to-1_MUX/OUT
CLK_OUT_4: port CLK_OUT_4, sheet U_8-to-1_MUX/OUT
CLK_OUT_5: port CLK_OUT_5, sheet U_8-to-1_MUX/OUT
CLK_OUT_6: port CLK_OUT_6, sheet U_8-to-1_MUX/OUT
CLK_OUT_7: port CLK_OUT_7, sheet U_8-to-1_MUX/OUT
OUT_0_SEL_0: sheet U_8-to-1_MUX/SEL0, port CLK_OUT_0_SEL.SEL0
OUT_0_SEL_1: sheet U_8-to-1_MUX/SEL1, port CLK_OUT_0_SEL.SEL1
OUT_0_SEL_2: sheet U_8-to-1_MUX/SEL2, port CLK_OUT_0_SEL.SEL2
OUT_1_SEL_0: sheet U_8-to-1_MUX/SEL0, port CLK_OUT_1_SEL.SEL0
OUT_1_SEL_1: sheet U_8-to-1_MUX/SEL1, port CLK_OUT_1_SEL.SEL1
OUT_1_SEL_2: sheet U_8-to-1_MUX/SEL2, port CLK_OUT_1_SEL.SEL2
OUT_2_SEL_0: sheet U_8-to-1_MUX/SEL0, port CLK_OUT_2_SEL.SEL0
OUT_2_SEL_1: sheet U_8-to-1_MUX/SEL1, port CLK_OUT_2_SEL.SEL1
OUT_2_SEL_2: sheet U_8-to-1_MUX/SEL2, port CLK_OUT_2_SEL.SEL2
OUT_3_SEL_0: sheet U_8-to-1_MUX/SEL0, port CLK_OUT_3_SEL.SEL0
OUT_3_SEL_1: sheet U_8-to-1_MUX/SEL1, port CLK_OUT_3_SEL.SEL1
OUT_3_SEL_2: sheet U_8-to-1_MUX/SEL2, port CLK_OUT_3_SEL.SEL2
OUT_4_SEL_0: sheet U_8-to-1_MUX/SEL0, port CLK_OUT_4_SEL.SEL0
OUT_4_SEL_1: sheet U_8-to-1_MUX/SEL1, port CLK_OUT_4_SEL.SEL1
OUT_4_SEL_2: sheet U_8-to-1_MUX/SEL2, port CLK_OUT_4_SEL.SEL2
OUT_5_SEL_0: sheet U_8-to-1_MUX/SEL0, port CLK_OUT_5_SEL.SEL0
OUT_5_SEL_1: sheet U_8-to-1_MUX/SEL1, port CLK_OUT_5_SEL.SEL1
OUT_5_SEL_2: sheet U_8-to-1_MUX/SEL2, port CLK_OUT_5_SEL.SEL2
OUT_6_SEL_0: sheet U_8-to-1_MUX/SEL0, port CLK_OUT_6_SEL.SEL0
OUT_6_SEL_1: sheet U_8-to-1_MUX/SEL1, port CLK_OUT_6_SEL.SEL1
OUT_6_SEL_2: sheet U_8-to-1_MUX/SEL2, port CLK_OUT_6_SEL.SEL2
OUT_7_SEL_0: sheet U_8-to-1_MUX/SEL0, port CLK_OUT_7_SEL.SEL0
OUT_7_SEL_1: sheet U_8-to-1_MUX/SEL1, port CLK_OUT_7_SEL.SEL1
OUT_7_SEL_2: sheet U_8-to-1_MUX/SEL2, port CLK_OUT_7_SEL.SEL2

### Buses and harness runs
harness CLK_0_OUT_0 = sheet U_1-to-8_Fanout/CLK_OUT_0
harness CLK_0_OUT_0 = sheet U_8-to-1_MUX/CLK_IN_0
harness CLK_0_OUT_1 = sheet U_1-to-8_Fanout/CLK_OUT_1
harness CLK_0_OUT_1 = sheet U_8-to-1_MUX/CLK_IN_0
harness CLK_0_OUT_2 = sheet U_1-to-8_Fanout/CLK_OUT_2
harness CLK_0_OUT_2 = sheet U_8-to-1_MUX/CLK_IN_0
harness CLK_0_OUT_3 = sheet U_1-to-8_Fanout/CLK_OUT_3
harness CLK_0_OUT_3 = sheet U_8-to-1_MUX/CLK_IN_0
harness CLK_0_OUT_4 = sheet U_1-to-8_Fanout/CLK_OUT_4
harness CLK_0_OUT_4 = sheet U_8-to-1_MUX/CLK_IN_0
harness CLK_0_OUT_5 = sheet U_1-to-8_Fanout/CLK_OUT_5
harness CLK_0_OUT_5 = sheet U_8-to-1_MUX/CLK_IN_0
harness CLK_0_OUT_6 = sheet U_1-to-8_Fanout/CLK_OUT_6
harness CLK_0_OUT_6 = sheet U_8-to-1_MUX/CLK_IN_0
harness CLK_0_OUT_7 = sheet U_1-to-8_Fanout/CLK_OUT_7
harness CLK_0_OUT_7 = sheet U_8-to-1_MUX/CLK_IN_0
harness CLK_1_OUT_0 = sheet U_1-to-8_Fanout/CLK_OUT_0
harness CLK_1_OUT_0 = sheet U_8-to-1_MUX/CLK_IN_1
harness CLK_1_OUT_1 = sheet U_1-to-8_Fanout/CLK_OUT_1
harness CLK_1_OUT_1 = sheet U_8-to-1_MUX/CLK_IN_1
harness CLK_1_OUT_2 = sheet U_1-to-8_Fanout/CLK_OUT_2
harness CLK_1_OUT_2 = sheet U_8-to-1_MUX/CLK_IN_1
harness CLK_1_OUT_3 = sheet U_1-to-8_Fanout/CLK_OUT_3
harness CLK_1_OUT_3 = sheet U_8-to-1_MUX/CLK_IN_1
harness CLK_1_OUT_4 = sheet U_1-to-8_Fanout/CLK_OUT_4
harness CLK_1_OUT_4 = sheet U_8-to-1_MUX/CLK_IN_1
harness CLK_1_OUT_5 = sheet U_1-to-8_Fanout/CLK_OUT_5
harness CLK_1_OUT_5 = sheet U_8-to-1_MUX/CLK_IN_1
harness CLK_1_OUT_6 = sheet U_1-to-8_Fanout/CLK_OUT_6
harness CLK_1_OUT_6 = sheet U_8-to-1_MUX/CLK_IN_1
harness CLK_1_OUT_7 = sheet U_1-to-8_Fanout/CLK_OUT_7
harness CLK_1_OUT_7 = sheet U_8-to-1_MUX/CLK_IN_1
harness CLK_2_OUT_0 = sheet U_1-to-8_Fanout/CLK_OUT_0
harness CLK_2_OUT_0 = sheet U_8-to-1_MUX/CLK_IN_2
harness CLK_2_OUT_1 = sheet U_1-to-8_Fanout/CLK_OUT_1
harness CLK_2_OUT_1 = sheet U_8-to-1_MUX/CLK_IN_2
harness CLK_2_OUT_2 = sheet U_1-to-8_Fanout/CLK_OUT_2
harness CLK_2_OUT_2 = sheet U_8-to-1_MUX/CLK_IN_2
harness CLK_2_OUT_3 = sheet U_1-to-8_Fanout/CLK_OUT_3
harness CLK_2_OUT_3 = sheet U_8-to-1_MUX/CLK_IN_2
harness CLK_2_OUT_4 = sheet U_1-to-8_Fanout/CLK_OUT_4
harness CLK_2_OUT_4 = sheet U_8-to-1_MUX/CLK_IN_2
harness CLK_2_OUT_5 = sheet U_1-to-8_Fanout/CLK_OUT_5
harness CLK_2_OUT_5 = sheet U_8-to-1_MUX/CLK_IN_2
harness CLK_2_OUT_6 = sheet U_1-to-8_Fanout/CLK_OUT_6
harness CLK_2_OUT_6 = sheet U_8-to-1_MUX/CLK_IN_2
harness CLK_2_OUT_7 = sheet U_1-to-8_Fanout/CLK_OUT_7
harness CLK_2_OUT_7 = sheet U_8-to-1_MUX/CLK_IN_2
harness CLK_3_OUT_0 = sheet U_1-to-8_Fanout/CLK_OUT_0
harness CLK_3_OUT_0 = sheet U_8-to-1_MUX/CLK_IN_3
harness CLK_3_OUT_1 = sheet U_1-to-8_Fanout/CLK_OUT_1
harness CLK_3_OUT_1 = sheet U_8-to-1_MUX/CLK_IN_3
harness CLK_3_OUT_2 = sheet U_1-to-8_Fanout/CLK_OUT_2
harness CLK_3_OUT_2 = sheet U_8-to-1_MUX/CLK_IN_3
harness CLK_3_OUT_3 = sheet U_1-to-8_Fanout/CLK_OUT_3
harness CLK_3_OUT_3 = sheet U_8-to-1_MUX/CLK_IN_3
harness CLK_3_OUT_4 = sheet U_1-to-8_Fanout/CLK_OUT_4
harness CLK_3_OUT_4 = sheet U_8-to-1_MUX/CLK_IN_3
harness CLK_3_OUT_5 = sheet U_1-to-8_Fanout/CLK_OUT_5
harness CLK_3_OUT_5 = sheet U_8-to-1_MUX/CLK_IN_3
harness CLK_3_OUT_6 = sheet U_1-to-8_Fanout/CLK_OUT_6
harness CLK_3_OUT_6 = sheet U_8-to-1_MUX/CLK_IN_3
harness CLK_3_OUT_7 = sheet U_1-to-8_Fanout/CLK_OUT_7
harness CLK_3_OUT_7 = sheet U_8-to-1_MUX/CLK_IN_3
harness CLK_4_OUT_0 = sheet U_1-to-8_Fanout/CLK_OUT_0
harness CLK_4_OUT_0 = sheet U_8-to-1_MUX/CLK_IN_4
harness CLK_4_OUT_1 = sheet U_1-to-8_Fanout/CLK_OUT_1
harness CLK_4_OUT_1 = sheet U_8-to-1_MUX/CLK_IN_4
harness CLK_4_OUT_2 = sheet U_1-to-8_Fanout/CLK_OUT_2
harness CLK_4_OUT_2 = sheet U_8-to-1_MUX/CLK_IN_4
harness CLK_4_OUT_3 = sheet U_1-to-8_Fanout/CLK_OUT_3
harness CLK_4_OUT_3 = sheet U_8-to-1_MUX/CLK_IN_4
harness CLK_4_OUT_4 = sheet U_1-to-8_Fanout/CLK_OUT_4
harness CLK_4_OUT_4 = sheet U_8-to-1_MUX/CLK_IN_4
harness CLK_4_OUT_5 = sheet U_1-to-8_Fanout/CLK_OUT_5
harness CLK_4_OUT_5 = sheet U_8-to-1_MUX/CLK_IN_4
harness CLK_4_OUT_6 = sheet U_1-to-8_Fanout/CLK_OUT_6
harness CLK_4_OUT_6 = sheet U_8-to-1_MUX/CLK_IN_4
harness CLK_4_OUT_7 = sheet U_1-to-8_Fanout/CLK_OUT_7
harness CLK_4_OUT_7 = sheet U_8-to-1_MUX/CLK_IN_4
harness CLK_5_OUT_0 = sheet U_1-to-8_Fanout/CLK_OUT_0
harness CLK_5_OUT_0 = sheet U_8-to-1_MUX/CLK_IN_5
harness CLK_5_OUT_1 = sheet U_1-to-8_Fanout/CLK_OUT_1
harness CLK_5_OUT_1 = sheet U_8-to-1_MUX/CLK_IN_5
harness CLK_5_OUT_2 = sheet U_1-to-8_Fanout/CLK_OUT_2
harness CLK_5_OUT_2 = sheet U_8-to-1_MUX/CLK_IN_5
harness CLK_5_OUT_3 = sheet U_1-to-8_Fanout/CLK_OUT_3
harness CLK_5_OUT_3 = sheet U_8-to-1_MUX/CLK_IN_5
harness CLK_5_OUT_4 = sheet U_1-to-8_Fanout/CLK_OUT_4
harness CLK_5_OUT_4 = sheet U_8-to-1_MUX/CLK_IN_5
harness CLK_5_OUT_5 = sheet U_1-to-8_Fanout/CLK_OUT_5
harness CLK_5_OUT_5 = sheet U_8-to-1_MUX/CLK_IN_5
harness CLK_5_OUT_6 = sheet U_1-to-8_Fanout/CLK_OUT_6
harness CLK_5_OUT_6 = sheet U_8-to-1_MUX/CLK_IN_5
harness CLK_5_OUT_7 = sheet U_1-to-8_Fanout/CLK_OUT_7
harness CLK_5_OUT_7 = sheet U_8-to-1_MUX/CLK_IN_5
harness CLK_6_OUT_0 = sheet U_1-to-8_Fanout/CLK_OUT_0
harness CLK_6_OUT_0 = sheet U_8-to-1_MUX/CLK_IN_6
harness CLK_6_OUT_1 = sheet U_1-to-8_Fanout/CLK_OUT_1
harness CLK_6_OUT_1 = sheet U_8-to-1_MUX/CLK_IN_6
harness CLK_6_OUT_2 = sheet U_1-to-8_Fanout/CLK_OUT_2
harness CLK_6_OUT_2 = sheet U_8-to-1_MUX/CLK_IN_6
harness CLK_6_OUT_3 = sheet U_1-to-8_Fanout/CLK_OUT_3
harness CLK_6_OUT_3 = sheet U_8-to-1_MUX/CLK_IN_6
harness CLK_6_OUT_4 = sheet U_1-to-8_Fanout/CLK_OUT_4
harness CLK_6_OUT_4 = sheet U_8-to-1_MUX/CLK_IN_6
harness CLK_6_OUT_5 = sheet U_1-to-8_Fanout/CLK_OUT_5
harness CLK_6_OUT_5 = sheet U_8-to-1_MUX/CLK_IN_6
harness CLK_6_OUT_6 = sheet U_1-to-8_Fanout/CLK_OUT_6
harness CLK_6_OUT_6 = sheet U_8-to-1_MUX/CLK_IN_6
harness CLK_6_OUT_7 = sheet U_1-to-8_Fanout/CLK_OUT_7
harness CLK_6_OUT_7 = sheet U_8-to-1_MUX/CLK_IN_6
harness CLK_7_OUT_0 = sheet U_1-to-8_Fanout/CLK_OUT_0
harness CLK_7_OUT_0 = sheet U_8-to-1_MUX/CLK_IN_7
harness CLK_7_OUT_1 = sheet U_1-to-8_Fanout/CLK_OUT_1
harness CLK_7_OUT_1 = sheet U_8-to-1_MUX/CLK_IN_7
harness CLK_7_OUT_2 = sheet U_1-to-8_Fanout/CLK_OUT_2
harness CLK_7_OUT_2 = sheet U_8-to-1_MUX/CLK_IN_7
harness CLK_7_OUT_3 = sheet U_1-to-8_Fanout/CLK_OUT_3
harness CLK_7_OUT_3 = sheet U_8-to-1_MUX/CLK_IN_7
harness CLK_7_OUT_4 = sheet U_1-to-8_Fanout/CLK_OUT_4
harness CLK_7_OUT_4 = sheet U_8-to-1_MUX/CLK_IN_7
harness CLK_7_OUT_5 = sheet U_1-to-8_Fanout/CLK_OUT_5
harness CLK_7_OUT_5 = sheet U_8-to-1_MUX/CLK_IN_7
harness CLK_7_OUT_6 = sheet U_1-to-8_Fanout/CLK_OUT_6
harness CLK_7_OUT_6 = sheet U_8-to-1_MUX/CLK_IN_7
harness CLK_7_OUT_7 = sheet U_1-to-8_Fanout/CLK_OUT_7
harness CLK_7_OUT_7 = sheet U_8-to-1_MUX/CLK_IN_7

### Notes on the sheet
- Copyright WUT ISE 2024.
  This source describes Open Hardware and is licensed under the CERN-OHLW v2
  You may redistribute and modify this documentation and make products
  using it under the terms of the CERN-OHL-W v2 (https:/cern.ch/cern-ohl).
  This documentation is distributed WITHOUT ANY EXPRESS OR IMPLIED
  WARRANTY, INCLUDING OF MERCHANTABILITY, SATISFACTORY QUALITY
  AND FITNESS FOR A PARTICULAR PURPOSE. Please see the CERN-OHL-W v2
  for applicable conditions.
  Source location: https://github.com/elhep/8x8-crosspoint-switch/
  As per CERN-OHL-W v2 section 4.1, should You produce hardware based on
  these sources, You must maintain the Source Location visible on the
  external case of the 8x8 Cross-point Swicth or other product you make using
  this documentation.
- Project/Equipment
- Document
- Designer
- Drawn by
- Check.by
- Contact
- File
- Last Mod.
- Print Date
- Sheet
- Size
- A3
- of
- Rev